# EAGLE design MRCS-Adapter-RJ11 (EAGLE 7.7.0)
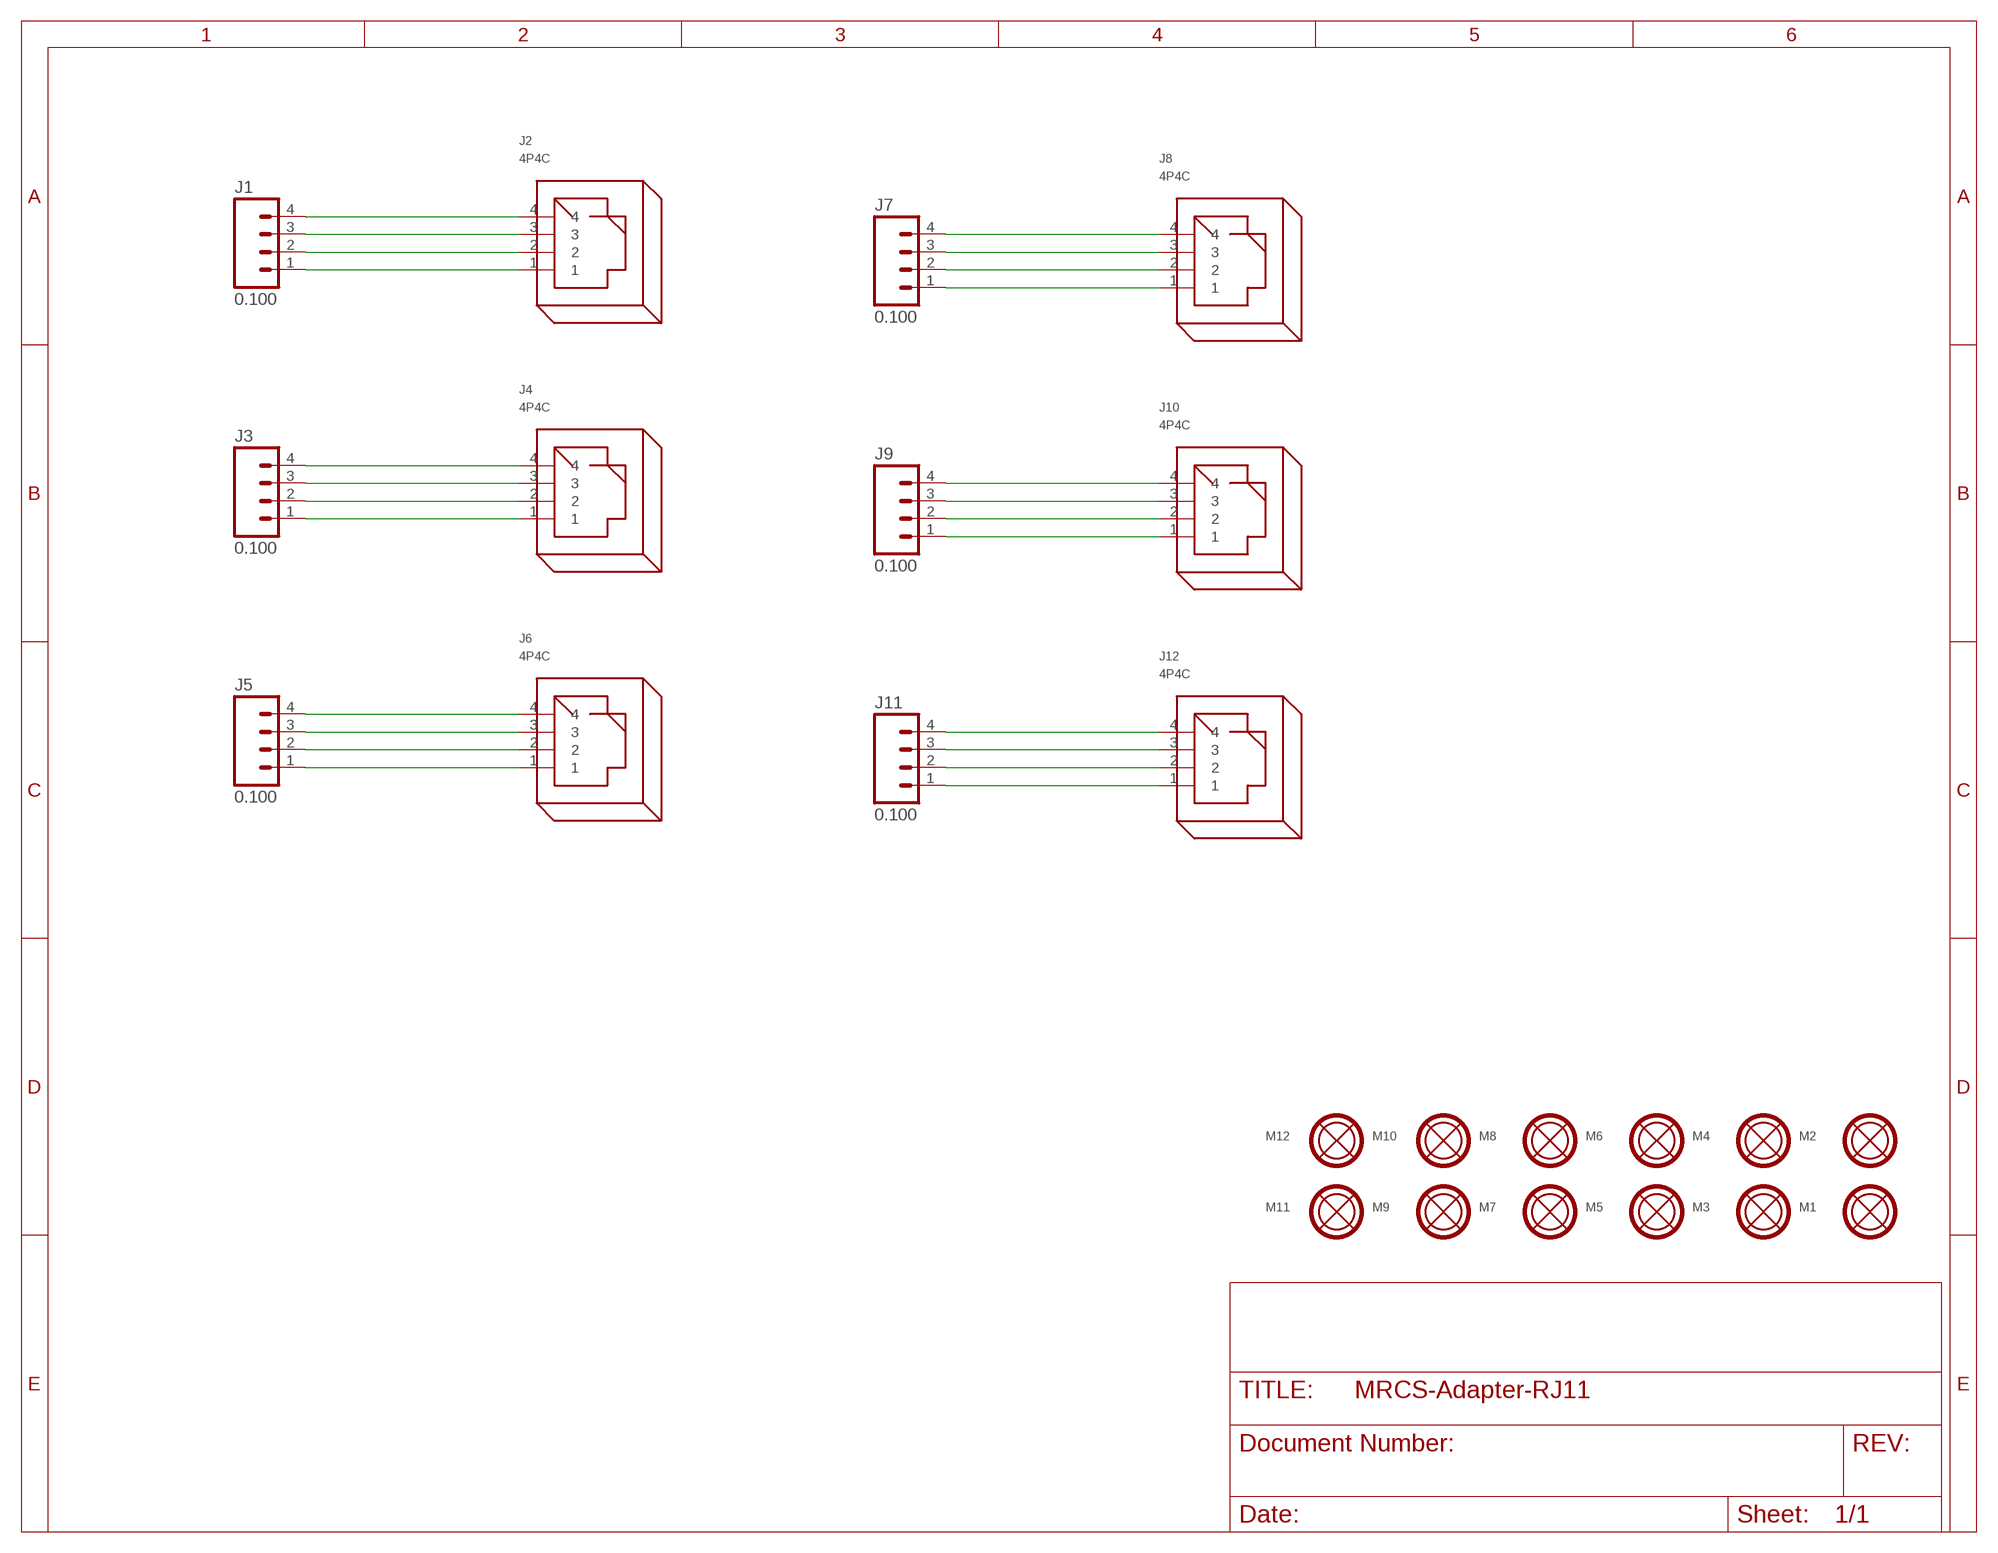
[diagram p0: schematic, sheet 1]

## Parts
J1  0.100  CONNECTOR-M04LOCK  [1X04_LOCK]
J2  4P4C  RJ11  [RJ11]
J3  0.100  CONNECTOR-M04LOCK  [1X04_LOCK]
J4  4P4C  RJ11  [RJ11]
J5  0.100  CONNECTOR-M04LOCK  [1X04_LOCK]
J6  4P4C  RJ11  [RJ11]
J7  0.100  CONNECTOR-M04LOCK  [1X04_LOCK]
J8  4P4C  RJ11  [RJ11]
J9  0.100  CONNECTOR-M04LOCK  [1X04_LOCK]
J10  4P4C  RJ11  [RJ11]
J11  0.100  CONNECTOR-M04LOCK  [1X04_LOCK]
J12  4P4C  RJ11  [RJ11]
M1  MOUNTINGHOLE  [MOUNTINGHOLE]
M2  MOUNTINGHOLE  [MOUNTINGHOLE]
M3  MOUNTINGHOLE  [MOUNTINGHOLE]
M4  MOUNTINGHOLE  [MOUNTINGHOLE]
M5  MOUNTINGHOLE  [MOUNTINGHOLE]
M6  MOUNTINGHOLE  [MOUNTINGHOLE]
M7  MOUNTINGHOLE  [MOUNTINGHOLE]
M8  MOUNTINGHOLE  [MOUNTINGHOLE]
M9  MOUNTINGHOLE  [MOUNTINGHOLE]
M10  MOUNTINGHOLE  [MOUNTINGHOLE]
M11  MOUNTINGHOLE  [MOUNTINGHOLE]
M12  MOUNTINGHOLE  [MOUNTINGHOLE]

## Nets
N$1: J1.1 J2.1
N$2: J1.2 J2.2
N$3: J1.3 J2.3
N$4: J1.4 J2.4
N$5: J3.1 J4.1
N$6: J3.2 J4.2
N$7: J3.3 J4.3
N$8: J3.4 J4.4
N$9: J5.1 J6.1
N$10: J5.2 J6.2
N$11: J5.3 J6.3
N$12: J5.4 J6.4
N$13: J7.1 J8.1
N$14: J7.2 J8.2
N$15: J7.3 J8.3
N$16: J7.4 J8.4
N$17: J9.1 J10.1
N$18: J9.2 J10.2
N$19: J9.3 J10.3
N$20: J9.4 J10.4
N$21: J11.1 J12.1
N$22: J11.2 J12.2
N$23: J11.3 J12.3
N$24: J11.4 J12.4

## Library data of the parts
J1 J3 J5 J7 J9 J11 = SPCoast:CONNECTOR-M04: Header 4 Standard 4-pin 0.1" header. Use with straight break away headers (SKU : PRT-00116), right angle break away headers (PRT-00553), swiss pins (PRT-00743), machine pins (PRT-00117), and female headers (PRT-00115). Molex polarized connector foot print use with SKU : PRT-08231 with associated crimp pins and housings. 1MM SMD Version SKU: PRT-10208
J2 J4 J6 J8 J10 J12 = con-rj:RJ11: RJ11, RJ22 RJ11 and RJ22 jacks side mounted http://www.tycoelectronics.com
M1-M12 = SPCoast:MOUNTINGHOLE: Mounting hole with top and bottom copper and stop rings

## Board
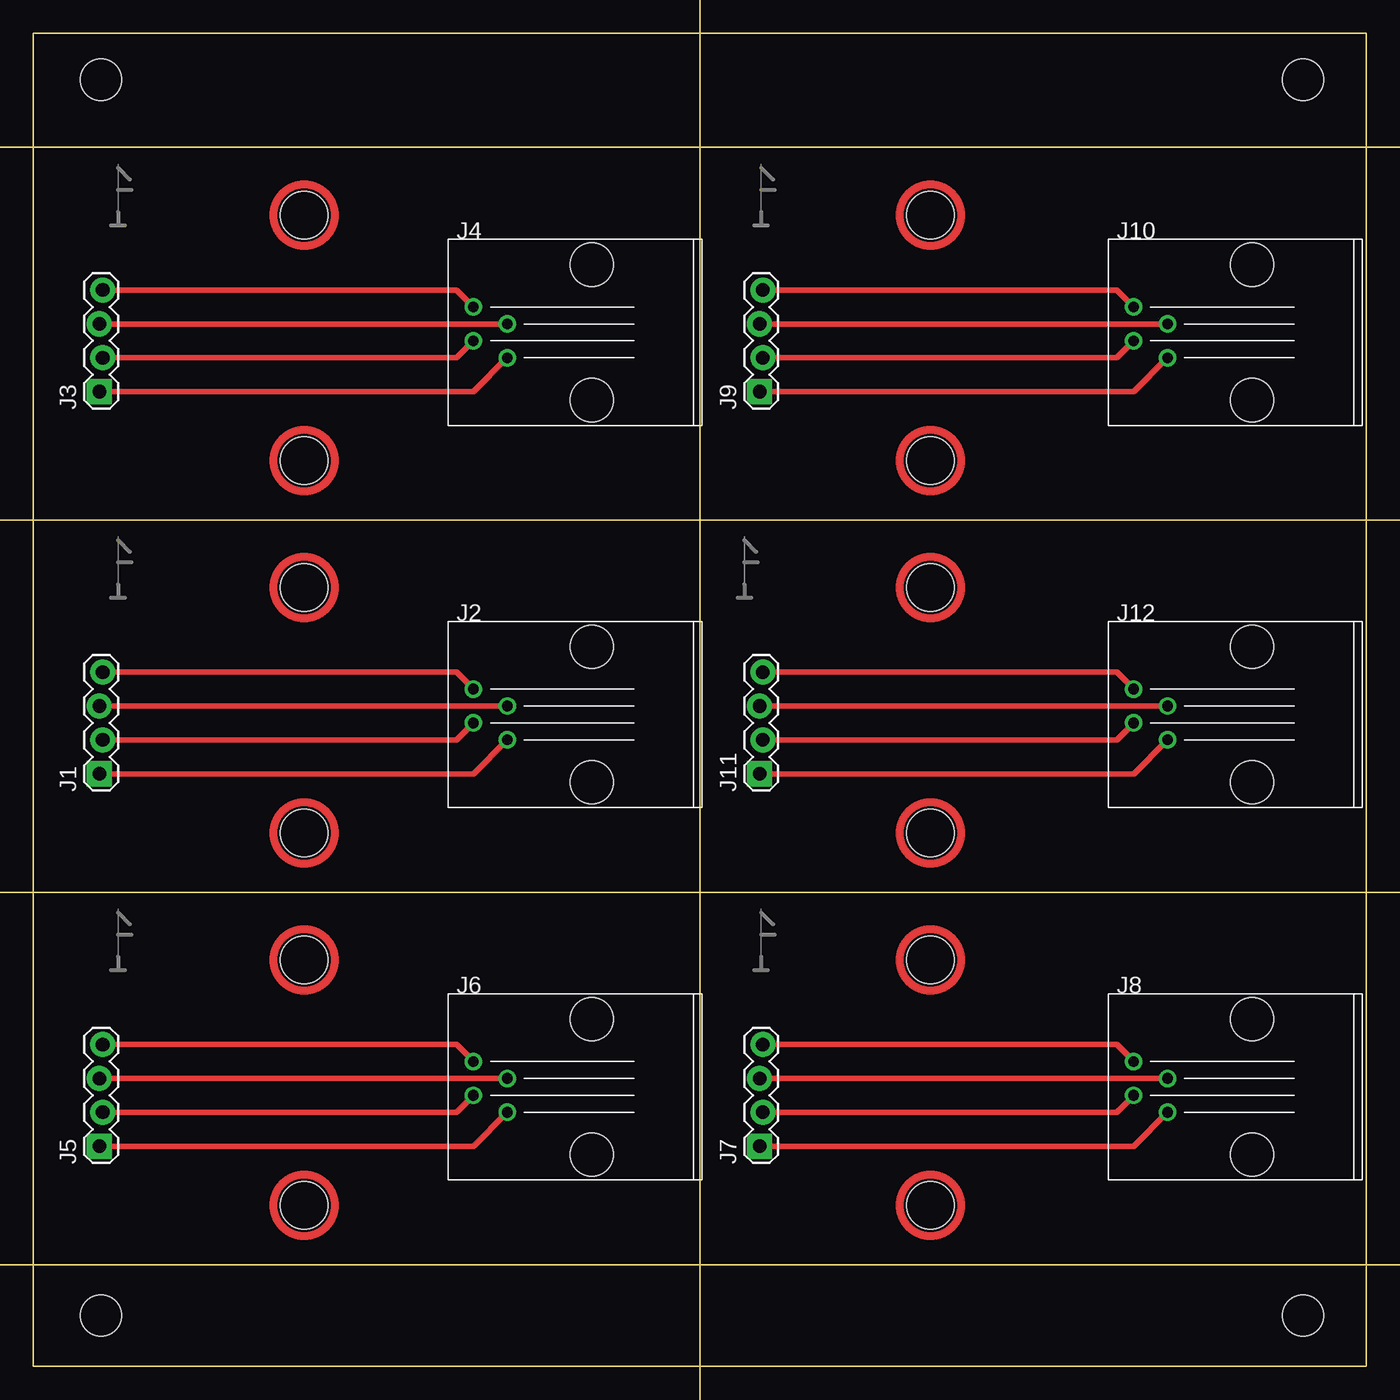
[diagram p1: board, top side]
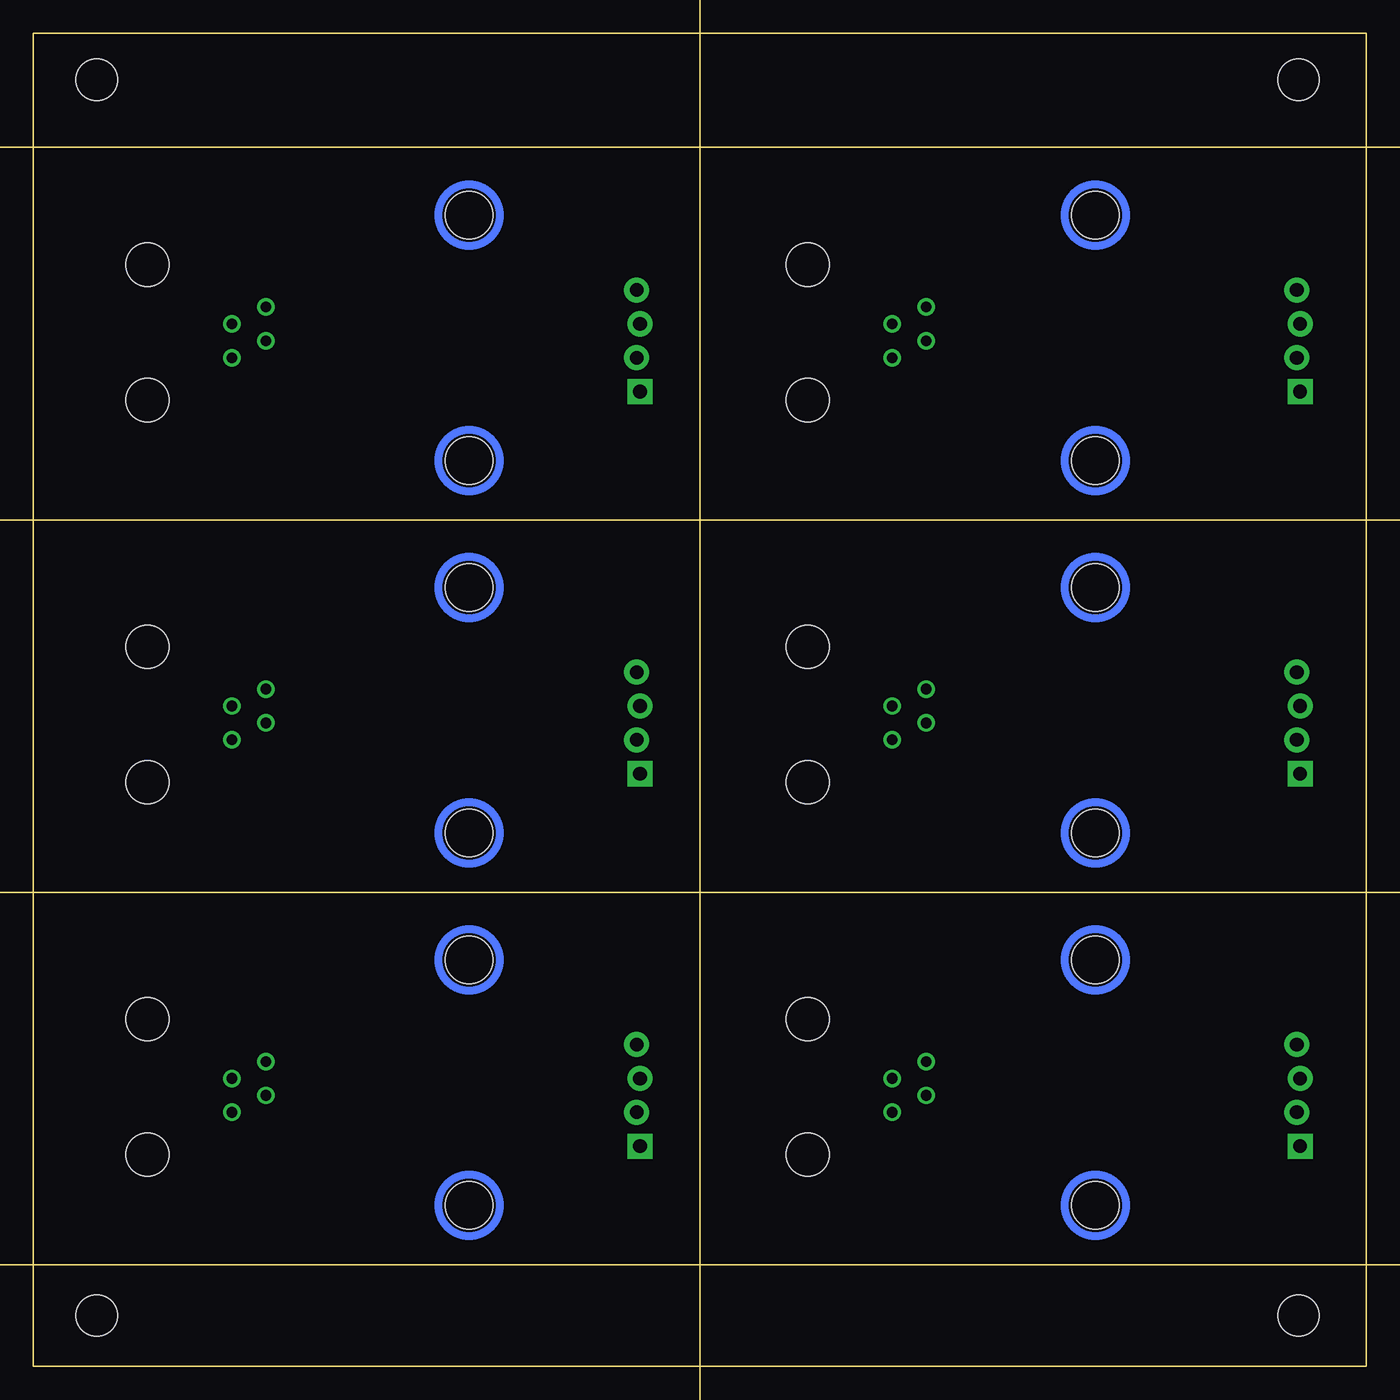
[diagram p2: board, bottom side, seen from below]

Size 100 x 100 mm. Coordinates in mm from the lower left corner, seen from the top.
Copper layers (1*16): Top 0.035mm / dielectric 1.5mm / Bottom 0.035mm
Design rules "default": minimum track width 10mil, minimum drill 24mil, track to track 8mil, track to pad 8mil, pad to pad 8mil, via to via 8mil, smd to smd 8mil, copper to edge 40mil, drill to drill 8mil, minimum pad ring 10mil, minimum via ring 8mil, stop-mask expansion 4mil, vias tented up to drill 0mil, thermal gap 10mil

### Footprints (pad centres in the part's own frame; a part is rotated, then mirrored left to right if it is on the bottom)
BOARD-10X10-3X2-PANEL = hole 3.1: 5.08,96.52; 95.25,96.52; 5.08,3.81; 95.25,3.81
1X04_LOCK = drill 1.016 pad 1.88 square: 1 0,0.127 | drill 1.016 pad 1.88: 2 2.54,-0.127; 3 5.08,0.127; 4 7.62,-0.127
RJ11 = drill 0.8: 1 -3.81,-2.54; 2 -6.35,-1.27; 3 -3.81,0; 4 -6.35,1.27 | hole 3.25: 2.54,-5.715; 2.54,4.445
MOUNTINGHOLE = hole 3.6: 0,0

### Placement (x,y rotation side)
E$1  10x10  [BOARD-10X10-3X2-PANEL]  0,0 0 top
J1  5.08,44.45 90 top
J2  39.37,49.53 0 top
J3  5.08,73.12 90 top
J4  39.37,78.2 0 top
J5  5.08,16.51 90 top
J6  39.37,21.59 0 top
J7  54.61,16.51 90 top
J8  88.9,21.59 0 top
J9  54.61,73.12 90 top
J10  88.9,78.2 0 top
J11  54.61,44.45 90 top
J12  88.9,49.53 0 top
M1  20.32,12.06 0 top
M2  20.32,30.48 0 top
M3  67.31,12.06 0 top
M4  67.31,30.48 0 top
M5  67.31,40.01 0 top
M6  20.32,40.01 0 top
M7  20.32,58.42 0 top
M8  67.31,58.42 0 top
M9  20.32,67.94 0 top
M10  67.31,67.94 0 top
M11  20.32,86.36 0 top
M12  67.31,86.36 0 top
U$1  MRCS  [MRCSLOGOTOP]  5.08,57.15 0 top
U$2  MRCS  [MRCSLOGOTOP]  52.07,57.15 0 top
U$3  MRCS  [MRCSLOGOTOP]  5.08,29.21 0 top
U$4  MRCS  [MRCSLOGOTOP]  53.34,29.21 0 top
U$5  MRCS  [MRCSLOGOTOP]  5.08,85.09 0 top
U$6  MRCS  [MRCSLOGOTOP]  53.34,85.09 0 top

### Tracks (layer width: path | path; a pad name or v marks a point on that pad's centre or on a via)
N$1
  Top 0.406: J1.1 33.02,44.45 J2.1
N$2
  Top 0.406: J1.2 31.75,46.99 J2.2
N$3
  Top 0.406: J1.3 J2.3
N$4
  Top 0.406: J1.4 31.75,52.07 J2.4
N$5
  Top 0.406: J3.1 33.02,73.12 J4.1
N$6
  Top 0.406: J3.2 31.75,75.66 J4.2
N$7
  Top 0.406: J3.3 J4.3
N$8
  Top 0.406: J3.4 31.75,80.74 J4.4
N$9
  Top 0.406: J5.1 33.02,16.51 J6.1
N$10
  Top 0.406: J5.2 31.75,19.05 J6.2
N$11
  Top 0.406: J5.3 J6.3
N$12
  Top 0.406: J5.4 31.75,24.13 J6.4
N$13
  Top 0.406: J7.1 82.55,16.51 J8.1
N$14
  Top 0.406: J7.2 81.28,19.05 J8.2
N$15
  Top 0.406: J7.3 J8.3
N$16
  Top 0.406: J7.4 81.28,24.13 J8.4
N$17
  Top 0.406: J9.1 82.55,73.12 J10.1
N$18
  Top 0.406: J9.2 81.28,75.66 J10.2
N$19
  Top 0.406: J9.3 J10.3
N$20
  Top 0.406: J9.4 81.28,80.74 J10.4
N$21
  Top 0.406: J11.1 82.55,44.45 J12.1
N$22
  Top 0.406: J11.2 81.28,46.99 J12.2
N$23
  Top 0.406: J11.3 J12.3
N$24
  Top 0.406: J11.4 81.28,52.07 J12.4

### Text on the board
tDocu: Handset / Breakout | Handset / Breakout | 2018.12 v1.0 | 2018.12 v1.0 | Handset / Breakout | Handset / Breakout | 2018.12 v1.0 | 2018.12 v1.0 | Handset / Breakout | Handset / Breakout | 2018.12 v1.0 | 2018.12 v1.0
bDocu: Red / White / White / Black | Red / White / White / Black | Red / White / White / Black